# Altium schematic sheet alt_modem.SchDoc
size A4
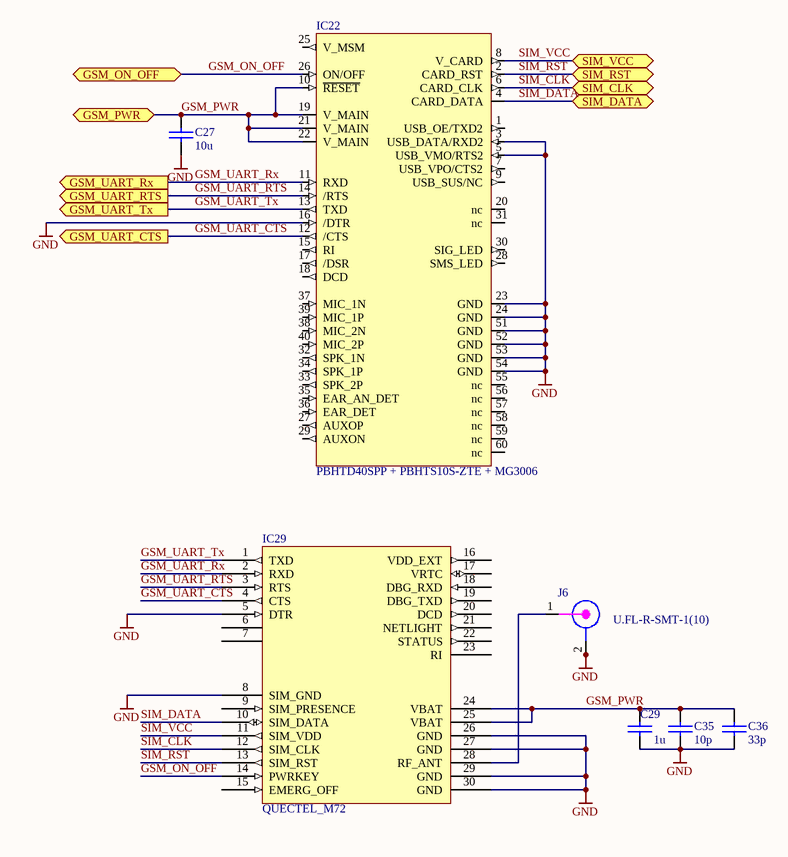
[diagram p0: alt_modem.SchDoc]

## Parts
C27  10u  [0805C]
C29  1u  [0603C]
C35  10p  [0603C]
C36  33p  [0603C]
IC22  PBHTD40SPP + PBHTS10S-ZTE + MG3006  [MG3006]
IC29  QUECTEL_M72  [QUECTEL_M72]
J6  U.FL-R-SMT-1(10)  [CON_UFL_HIROSE_RECEPTACLE]

## Ports
GSM_ON_OFF, GSM_PWR, GSM_UART_CTS (out), GSM_UART_RTS (out), GSM_UART_Rx (out), GSM_UART_Tx (out), SIM_CLK, SIM_DATA, SIM_RST, SIM_VCC

## Nets
GND: C27.2 C29.2 C35.2 C36.2 IC22.3(USB_DATA/RXD2) IC22.5(USB_VMO/RTS2) IC22.16(/DTR) IC22.23(GND) IC22.24(GND) IC22.51(GND) IC22.52(GND) IC22.53(GND) IC22.54(GND) IC29.5(DTR) IC29.8(SIM_GND) IC29.26(GND) IC29.27(GND) IC29.29(GND) IC29.30(GND) J6.2 J6.2a(GND)
GSM_ON_OFF: IC22.26(ON/OFF) IC29.14(PWRKEY) ; port GSM_ON_OFF
GSM_PWR: C27.1 C29.1 C35.1 C36.1 IC22.10(~{RESET}) IC22.19(V_MAIN) IC22.21(V_MAIN) IC22.22(V_MAIN) IC29.24(VBAT) IC29.25(VBAT) ; port GSM_PWR
GSM_UART_CTS: IC22.12(/CTS) IC29.4(CTS) ; port GSM_UART_CTS
GSM_UART_RTS: IC22.14(/RTS) IC29.3(RTS) ; port GSM_UART_RTS
GSM_UART_Rx: IC22.11(RXD) IC29.2(RXD) ; port GSM_UART_Rx
GSM_UART_Tx: IC22.13(TXD) IC29.1(TXD) ; port GSM_UART_Tx
SIM_CLK: IC22.6(CARD_CLK) IC29.12(SIM_CLK) ; port SIM_CLK
SIM_DATA: IC22.4(CARD_DATA) IC29.10(SIM_DATA) ; port SIM_DATA
SIM_RST: IC22.2(CARD_RST) IC29.13(SIM_RST) ; port SIM_RST
SIM_VCC: IC22.8(V_CARD) IC29.11(SIM_VDD) ; port SIM_VCC
NetIC29_28: IC29.28(RF_ANT) J6.1

Not connected (* = marked no-connect by the designer): IC22 1(USB_OE/TXD2) 7(USB_VPO/CTS2) 9(USB_SUS/NC) 15(RI) 17(/DSR) 18(DCD) 20(nc) 25(V_MSM) 27(AUXOP) 28(SMS_LED) 29(AUXON) 30(SIG_LED) 31(nc) 32(SPK_1N) 33(SPK_2P) 34(SPK_1P) 35(EAR_AN_DET) 36(EAR_DET) 37(MIC_1N) 38(MIC_2N) 39(MIC_1P) 40(MIC_2P) 55(nc) 56(nc) 57(nc) 58(nc) 59(nc) 60(nc); IC29 6(Reserved) 7(Reserved) 9(SIM_PRESENCE) 15(EMERG_OFF) 16(VDD_EXT) 17(VRTC) 18(DBG_RXD) 19(DBG_TXD) 20(DCD) 21(NETLIGHT) 22(STATUS) 23(RI)

## Library data of the parts
C27 C29 C35 C36 = CAP_general: Capacitor
IC22 = RF_GSM_MG3006
J6 = CON_UFL_SMD: UFL